# EAGLE schematic BleShield (EAGLE 6.2)
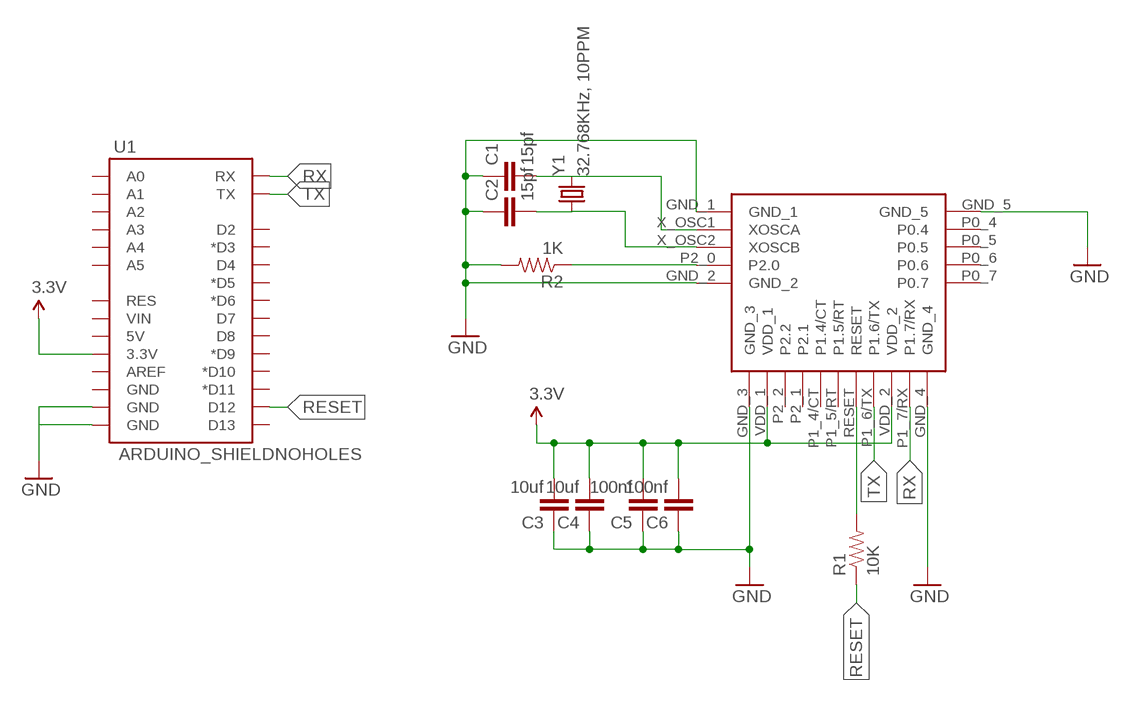
[diagram p0: schematic, sheet 1]

## Parts
C1  15pf  CAP0805  [0805]
C2  15pf  CAP0805  [0805]
C3  10uf  CAP0805  [0805]
C4  10uf  CAP0805  [0805]
C5  100nf  CAP0805  [0805]
C6  100nf  CAP0805  [0805]
R1  10K  RESISTOR0805-RES  [0805]
R2  1K  RESISTOR0805-RES  [0805]
U1  ARDUINO_SHIELDNOHOLES  [DUEMILANOVE_SHIELD_NOHOLES]
U$1  BG213L  [BG312L]
Y1  32.768KHz, 10PPM  CRYSTAL32-SMD  [CRYSTAL-32KHZ-SMD]

## Nets
3.3V: C3.2 C4.2 C5.2 C6.2 U1.3.3V U$1.VDD_1 U$1.VDD_2
GND: C1.1 C2.1 C3.1 C4.1 C5.1 C6.1 R2.2 U1.GND@0(GND) U1.GND@1(GND) U$1.GND_1 U$1.GND_2 U$1.GND_3 U$1.GND_4 U$1.GND_5
N$1: R1.2 U$1.RESET
N$2: R2.1 U$1.P2_0(P2.0)
N$3: C1.2 U$1.X_OSC1(XOSCA) Y1.X2
N$4: C2.2 U$1.X_OSC2(XOSCB) Y1.X1
RESET: R1.1 U1.D12
RX: U1.RX U$1.P1_7/RX(P1.7/RX)
TX: U1.TX U$1.P1_6/TX(P1.6/TX)
Unconnected: U1.5V U1.A0 U1.A1 U1.A2 U1.A3 U1.A4 U1.A5 U1.AREF U1.D2 U1.D3(*D3) U1.D4 U1.D5(*D5) U1.D6(*D6) U1.D7 U1.D8 U1.D9(*D9) U1.D10(*D10) U1.D11(*D11) U1.D13 U1.GND@2(GND) U1.RES U1.VIN U$1.P0_4(P0.4) U$1.P0_5(P0.5) U$1.P0_6(P0.6) U$1.P0_7(P0.7) U$1.P1_4/CT(P1.4/CT) U$1.P1_5/RT(P1.5/RT) U$1.P2_1(P2.1) U$1.P2_2(P2.2)

## Library data of the parts
C1-C6 = SparkFun:CAP: Capacitor Standard 0603 ceramic capacitor, and 0.1" leaded capacitor.
R1 R2 = SparkFun:RESISTOR: Resistor Basic schematic elements and footprints for 0603, 1206, and PTH resistors.
U1 = SparkFun:ARDUINO_SHIELD
U$1 = BLE:BG213L
Y1 = SparkFun:CRYSTAL: Crystals Various standard crystals. Proven footprints. Spark Fun Electronics SKU : COM-00534